# EAGLE schematic scheme (EAGLE 9.6.1)
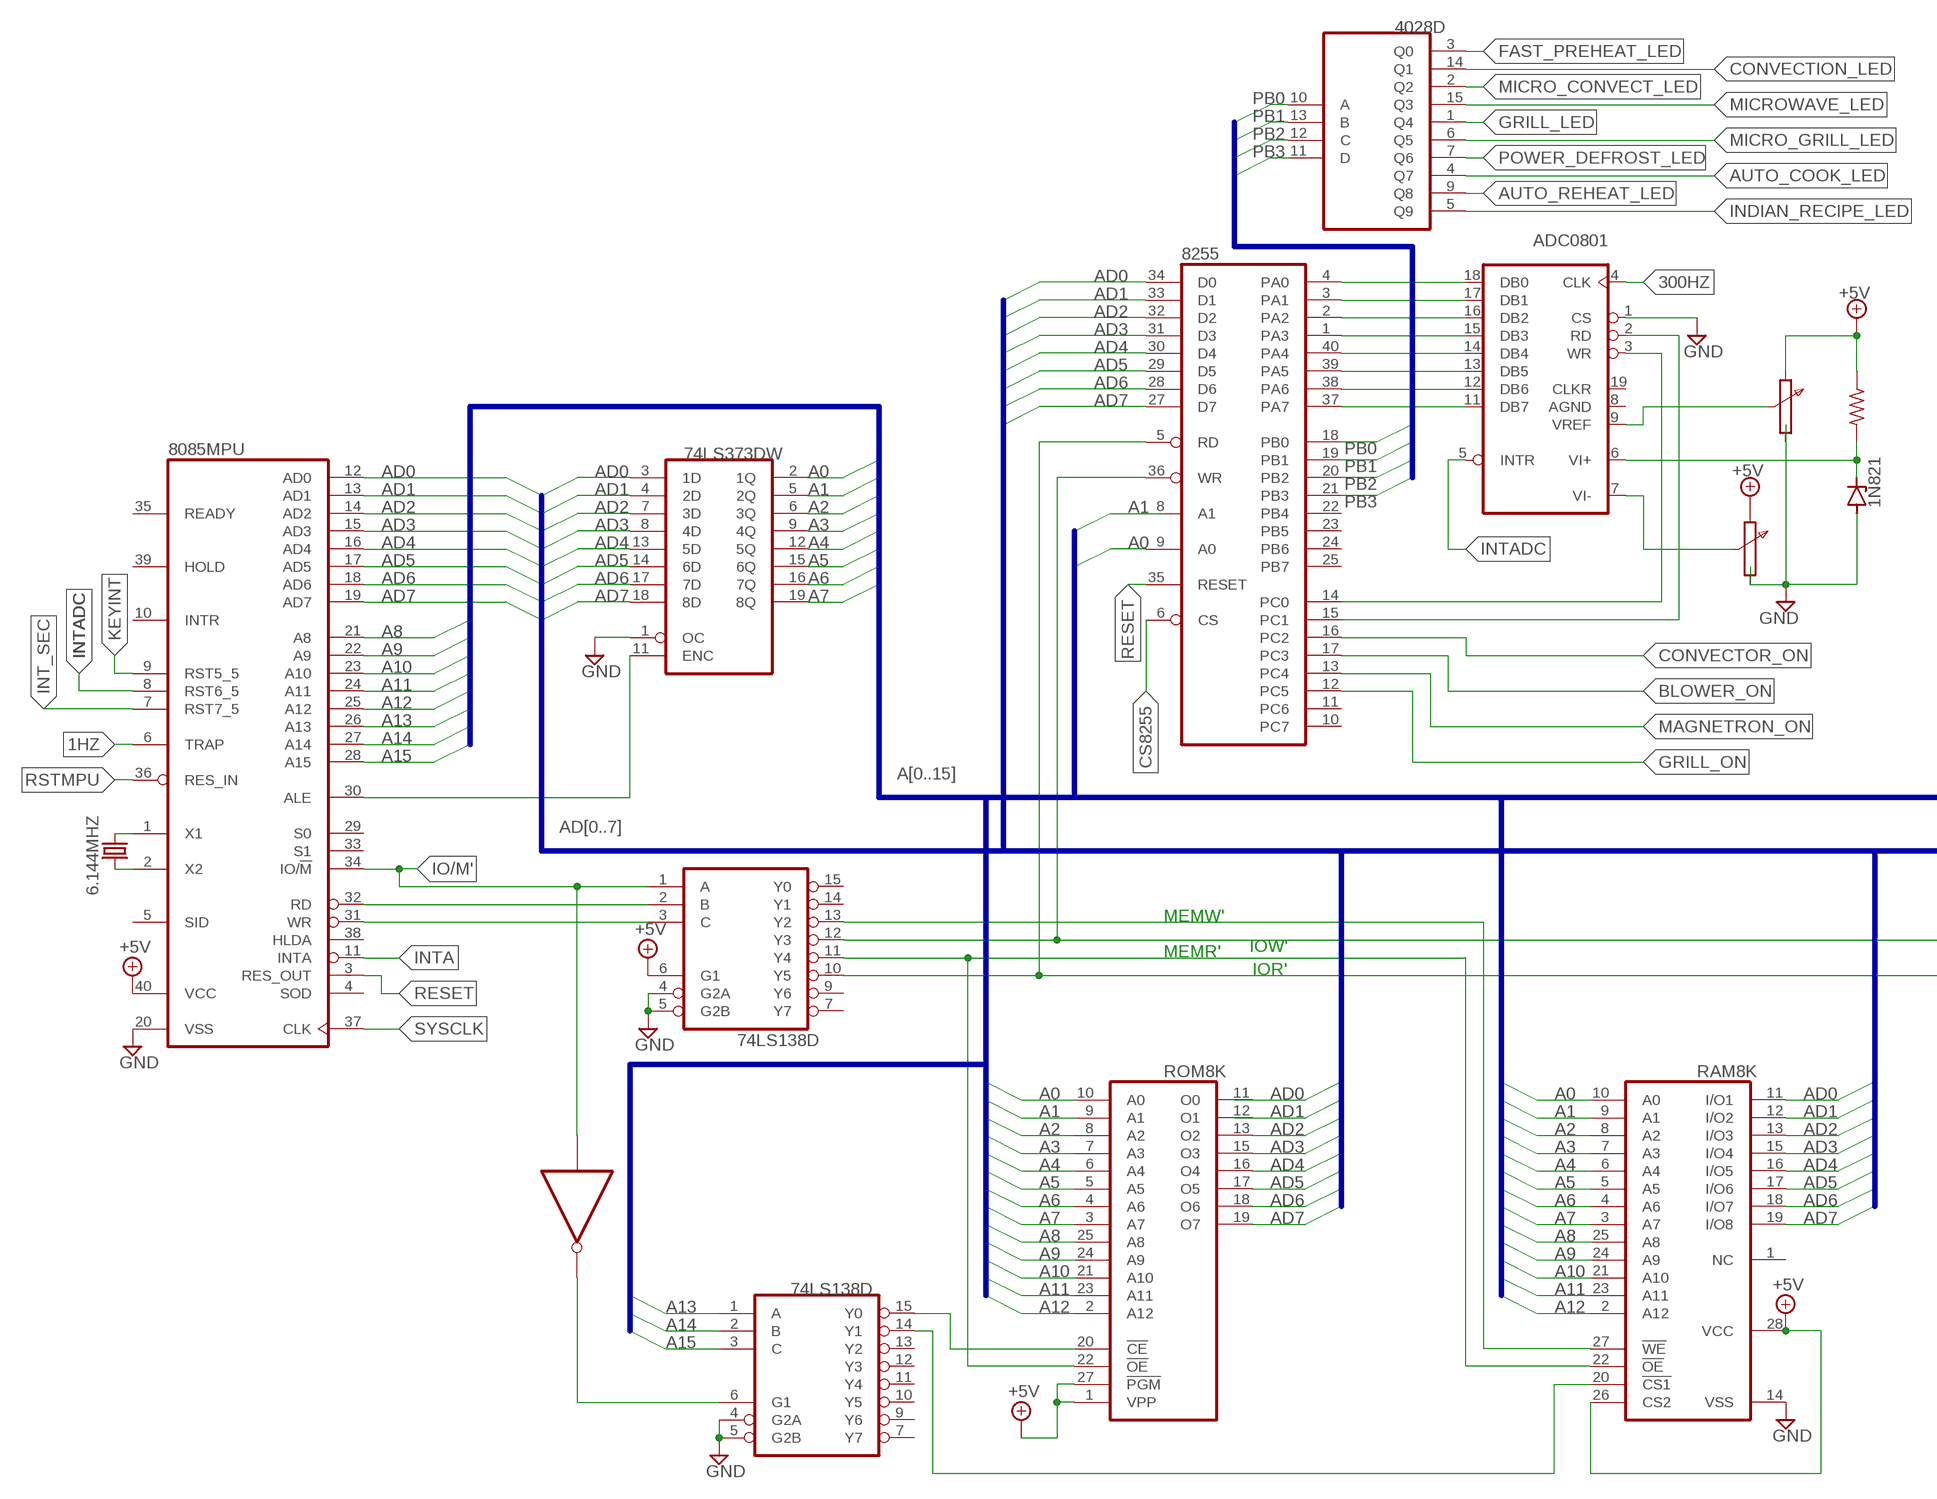
[diagram p0: schematic, sheet 1, part 1 of 2]
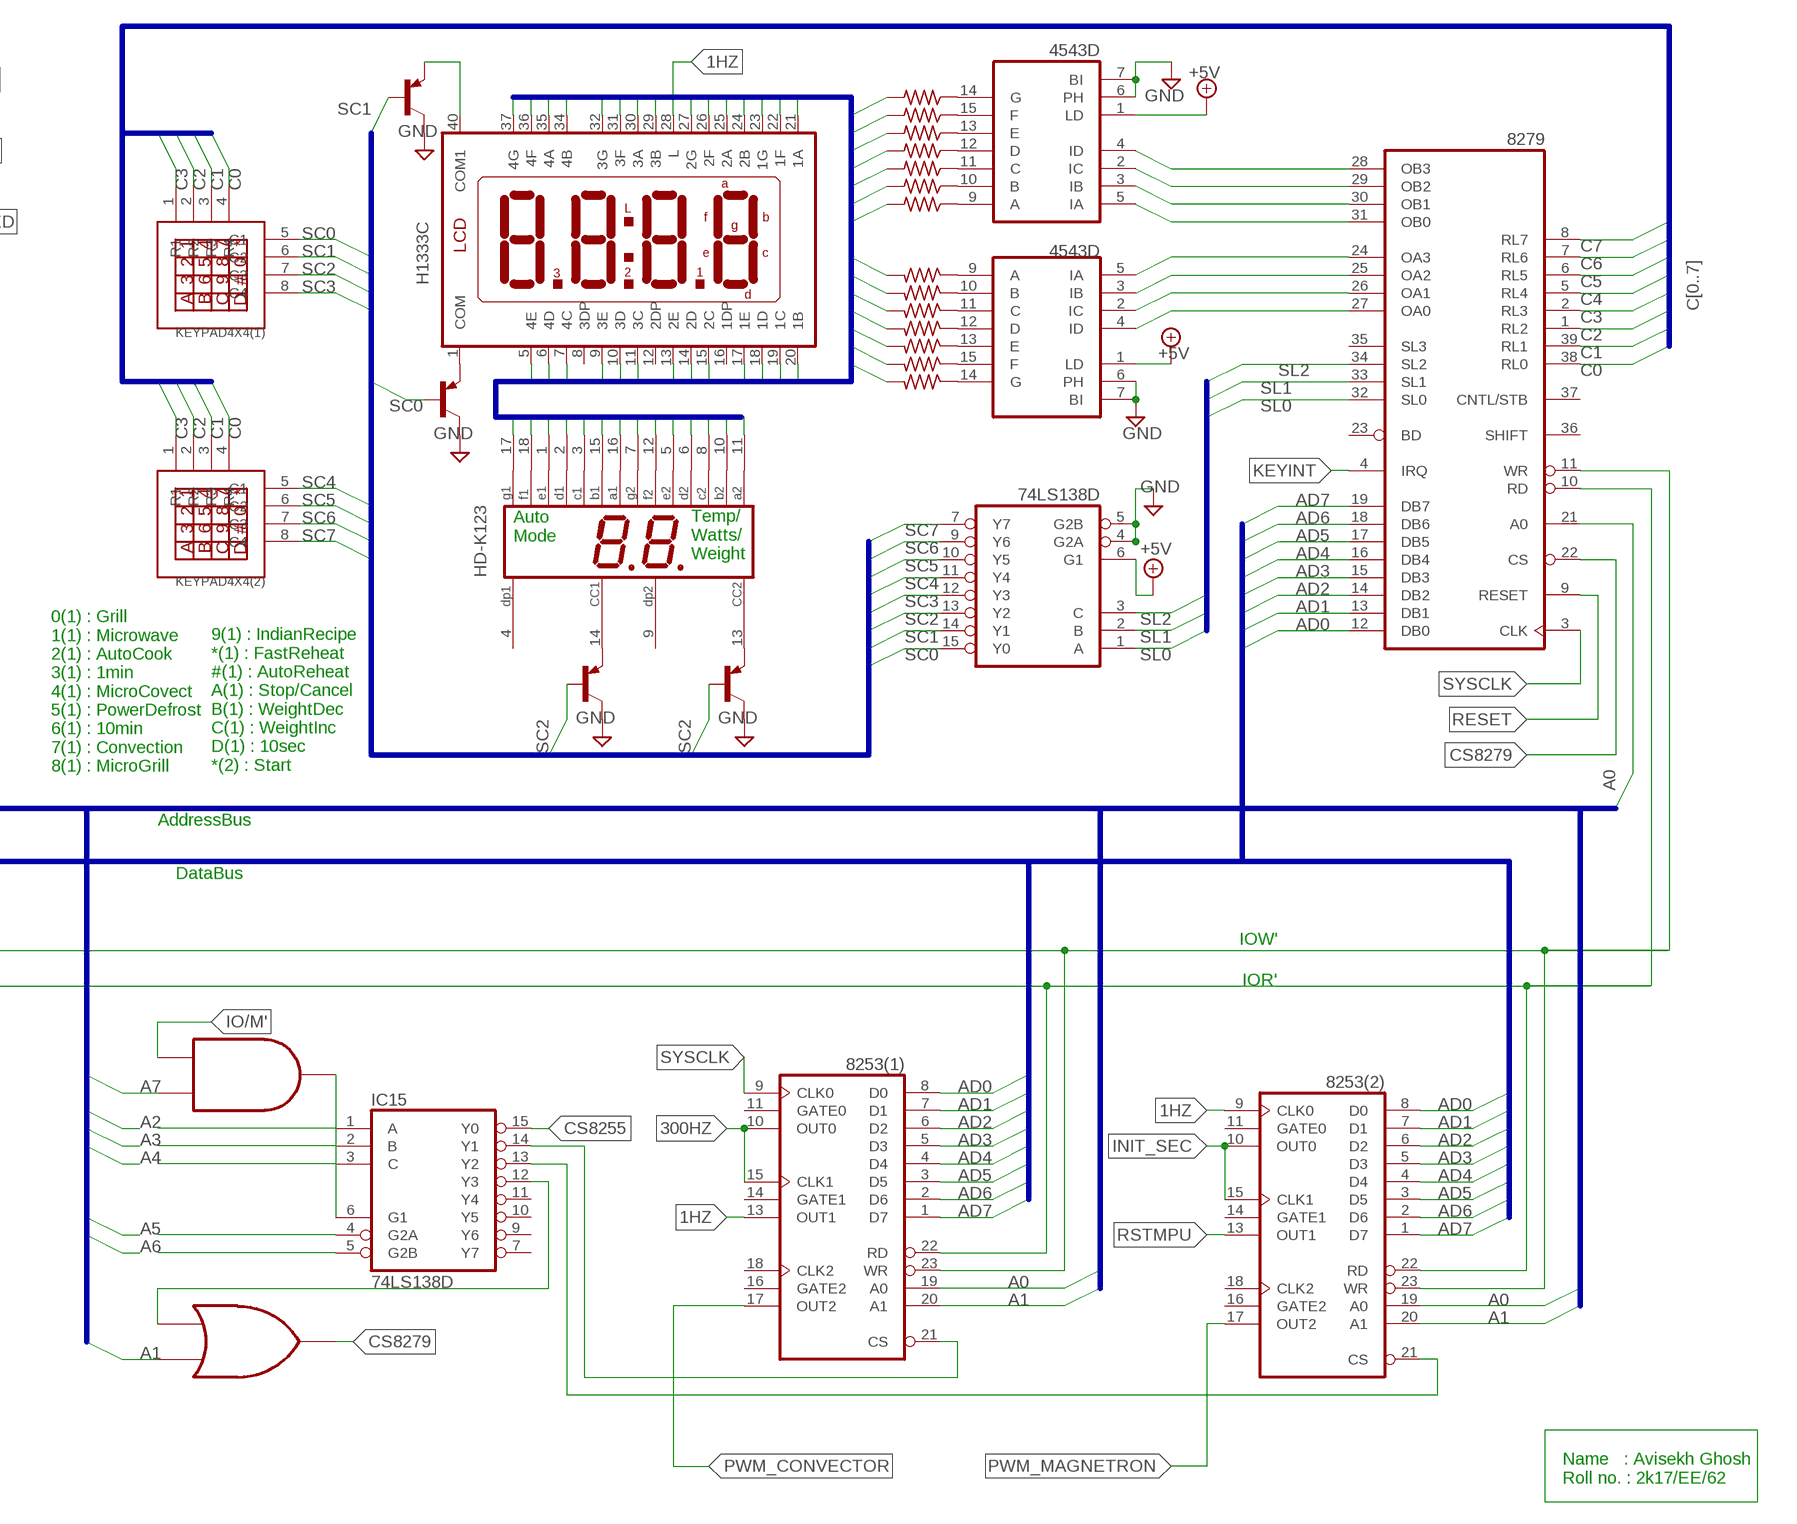
[diagram p1: schematic, sheet 1, part 2 of 2]

## Parts
6.144MHZ  CSM-7X-DU  [CSM-7X-DU]
8085MPU  8085  [DIL40]
8253(1)  8253  [DIL24-6]
8253(2)  8253  [DIL24-6]
8255  8255A  [DIL40]
8279  8279  [DIL40]
D1  1N821  [DO35Z10]
DIS2  H1333C  [H1333C]
DIS3  HD-K123  [HDSP-R]
IC1  4028D  [SO16]
IC2  74LS373DW  [SO20W]
IC3  74LS138D  [SO16]
IC14  74LS138D  [SO16]
IC15  74LS138D  [SO16]
IC19  ADC0801  [DIL20]
IC21  74LS138D  [SO16]
IC25  4543D  [SO16]
IC26  4543D  [SO16]
KEYPAD4X4(1)  KEYPAD4X4(1)  KEYPAD4X4  [KEYPAD4X4]
Q2  2N2907  [TO92-EBC-OVAL]
Q5  2N2907  [TO92-EBC-OVAL]
Q6  2N2907  [TO92-EBC-OVAL]
Q7  2N2907  [TO92-EBC-OVAL]
R1  10K  R-US_0207/12  [0207/12]
R57  10K  R-US_0207/12  [0207/12]
R58  10K  R-US_0207/12  [0207/12]
R59  10K  R-US_0207/12  [0207/12]
R60  10K  R-US_0207/12  [0207/12]
R61  10K  R-US_0207/12  [0207/12]
R62  10K  R-US_0207/12  [0207/12]
R63  10K  R-US_0207/12  [0207/12]
R64  10K  R-US_0207/12  [0207/12]
R65  10K  R-US_0207/12  [0207/12]
R66  10K  R-US_0207/12  [0207/12]
R67  10K  R-US_0207/12  [0207/12]
R68  10K  R-US_0207/12  [0207/12]
R69  10K  R-US_0207/12  [0207/12]
R70  10K  R-US_0207/12  [0207/12]
RAM8K  6264A  [DIL28-6]
ROM8K  2764  [DIL28]
U$2  KEYPAD4X4(2)  KEYPAD4X4  [KEYPAD4X4]
X1  INVERTER  (no package)
X2  AND  (no package)
X3  OR  (no package)

## Nets
1HZ: 8085MPU.6(TRAP) 8253(1).13(OUT1) 8253(2).9(CLK0) DIS2.28(L)
300HZ: 8253(1).10(OUT0) 8253(1).15(CLK1) IC19.4(CLK)
+5V: 8085MPU.40(VCC) IC3.6(G1) IC21.6(G1) IC25.1(LD) IC26.1(LD) R1.1 RAM8K.26(CS2) RAM8K.28(VCC) ROM8K.1(VPP) ROM8K.27(!PGM)
A0: 8253(1).19(A0) 8253(2).19(A0) 8255.9(A0) 8279.21(A0) DIS2.11(3C) DIS2.21(1A) DIS2.30(3A) DIS3.16(A1) IC2.2(1Q) R64.2 RAM8K.10(A0) ROM8K.10(A0)
A1: 8253(1).20(A1) 8253(2).20(A1) 8255.8(A1) DIS2.25(2A) DIS2.35(4A) DIS3.11(A2) IC2.5(2Q) R57.2 RAM8K.9(A1) ROM8K.9(A1) X3.B
A2: IC2.6(3Q) RAM8K.8(A2) ROM8K.8(A2)
A3: IC2.9(4Q) RAM8K.7(A3) ROM8K.7(A3)
A4: IC2.12(5Q) RAM8K.6(A4) ROM8K.6(A4)
A5: IC2.15(6Q) RAM8K.5(A5) ROM8K.5(A5)
A6: IC2.16(7Q) RAM8K.4(A6) ROM8K.4(A6)
A7: IC2.19(8Q) RAM8K.3(A7) ROM8K.3(A7) X2.B
A8: 8085MPU.21(A8) RAM8K.25(A8) ROM8K.25(A8)
A9: 8085MPU.22(A9) RAM8K.24(A9) ROM8K.24(A9)
A10: 8085MPU.23(A10) RAM8K.21(A10) ROM8K.21(A10)
A11: 8085MPU.24(A11) RAM8K.23(A11) ROM8K.23(A11)
A12: 8085MPU.25(A12) RAM8K.2(A12) ROM8K.2(A12)
A13: 8085MPU.26(A13) IC14.1(A)
A14: 8085MPU.27(A14) IC14.2(B)
A15: 8085MPU.28(A15) IC14.3(C)
AD0: 8085MPU.12(AD0) 8253(1).8(D0) 8253(2).8(D0) 8255.34(D0) 8279.12(DB0) IC2.3(1D) RAM8K.11(I/O1)
AD1: 8085MPU.13(AD1) 8253(1).7(D1) 8253(2).7(D1) 8255.33(D1) 8279.13(DB1) IC2.4(2D) RAM8K.12(I/O2)
AD2: 8085MPU.14(AD2) 8253(1).6(D2) 8253(2).6(D2) 8255.32(D2) 8279.14(DB2) IC2.7(3D) RAM8K.13(I/O3) ROM8K.13(O2)
AD3: 8085MPU.15(AD3) 8253(1).5(D3) 8253(2).5(D3) 8255.31(D3) 8279.15(DB3) IC2.8(4D) RAM8K.15(I/O4) ROM8K.15(O3)
AD4: 8085MPU.16(AD4) 8253(1).4(D4) 8253(2).4(D4) 8255.30(D4) 8279.16(DB4) IC2.13(5D) RAM8K.16(I/O5) ROM8K.16(O4)
AD5: 8085MPU.17(AD5) 8253(1).3(D5) 8253(2).3(D5) 8255.29(D5) 8279.17(DB5) IC2.14(6D) RAM8K.17(I/O6) ROM8K.17(O5)
AD6: 8085MPU.18(AD6) 8253(1).2(D6) 8253(2).2(D6) 8255.28(D6) 8279.18(DB6) IC2.17(7D) RAM8K.18(I/O7) ROM8K.18(O6)
AD7: 8085MPU.19(AD7) 8253(1).1(D7) 8253(2).1(D7) 8255.27(D7) 8279.19(DB7) IC2.18(8D) RAM8K.19(I/O8) ROM8K.19(O7)
AUTO_COOK_LED: IC1.4(Q7)
AUTO_REHEAT_LED: IC1.9(Q8)
B0: DIS2.20(1B) DIS2.29(3B) DIS3.15(B1) R65.2
B1: DIS2.24(2B) DIS2.34(4B) DIS3.10(B2) R58.2
BLOWER_ON: 8255.17(PC3)
C0: 8279.38(RL0) DIS2.19(1C) DIS3.3(C1) KEYPAD4X4(1).4(R4) R66.2 U$2.4(R4)
C1: 8279.39(RL1) DIS2.7(4C) DIS2.15(2C) DIS3.8(C2) KEYPAD4X4(1).3(R3) R59.2 U$2.3(R3)
C2: 8279.1(RL2) KEYPAD4X4(1).2(R2) U$2.2(R2)
C3: 8279.2(RL3) KEYPAD4X4(1).1(R1) U$2.1(R1)
C4: 8279.5(RL4)
C5: 8279.6(RL5)
C6: 8279.7(RL6)
C7: 8279.8(RL7)
CONVECTION_LED: IC1.14(Q1)
CONVECTOR_ON: 8255.16(PC2)
CS8255: 8255.6(CS) IC15.15(Y0)
CS8279: 8279.22(CS) X3.Y
D0: DIS2.10(3D) DIS2.18(1D) DIS3.2(D1) R67.2
D1: DIS2.6(4D) DIS2.14(2D) DIS3.6(D2) R60.2
E0: DIS2.9(3E) DIS2.17(1E) DIS3.1(E1) R68.2
E1: DIS2.5(4E) DIS2.13(2E) DIS3.5(E2) R61.2
F0: DIS2.22(1F) DIS2.31(3F) DIS3.18(F1) R69.2
F1: DIS2.26(2F) DIS2.36(4F) DIS3.12(F2) R62.2
FAST_PREHEAT_LED: IC1.3(Q0)
G0: DIS2.23(1G) DIS2.32(3G) DIS3.17(G1) R70.2
G1: DIS2.27(2G) DIS2.37(4G) DIS3.7(G2) R63.2
GND: 8085MPU.20(VSS) D1.A IC2.1(OC) IC3.4(G2A) IC3.5(G2B) IC14.4(G2A) IC14.5(G2B) IC19.1(CS) IC21.4(G2A) IC21.5(G2B) IC25.6(PH) IC25.7(BI) IC26.6(PH) IC26.7(BI) Q2.C Q5.C Q6.C Q7.C RAM8K.14(VSS)
GRILL_LED: IC1.1(Q4)
GRILL_ON: 8255.12(PC5)
INDIAN_RECIPE_LED: IC1.5(Q9)
INIT_SEC: 8253(2).10(OUT0) 8253(2).15(CLK1)
INT_SEC: 8085MPU.7(RST7_5)
INTA: 8085MPU.11(INTA)
INTADC: 8085MPU.8(RST6_5) IC19.5(INTR)
IO/M': 8085MPU.34(IO/!M) IC3.1(A) X1.I X2.A
KEYINT: 8085MPU.9(RST5_5) 8279.4(IRQ)
MAGNETRON_ON: 8255.13(PC4)
MICRO_CONVECT_LED: IC1.2(Q2)
MICRO_GRILL_LED: IC1.6(Q5)
MICROWAVE_LED: IC1.15(Q3)
N$1: 8085MPU.30(ALE) IC2.11(ENC)
N$2: 8085MPU.32(RD) IC3.2(B)
N$3: 8085MPU.31(WR) IC3.3(C)
N$4: IC15.6(G1) X2.Y
N$5: IC3.11(Y4) RAM8K.22(!OE) ROM8K.22(!OE)
N$6: IC3.13(Y2) RAM8K.27(!WE)
N$7: ROM8K.11(O0)
N$8: D1.C IC19.6(VI+) R1.2
N$9: IC15.1(A)
N$10: IC15.2(B)
N$11: IC15.3(C)
N$12: IC15.4(G2A)
N$13: IC15.5(G2B)
N$14: IC15.12(Y3) X3.A
N$15: DIS3.14(CC1) Q2.E
N$16: DIS3.13(CC2) Q5.E
N$17: 8253(1).23(WR) 8253(2).23(WR) 8255.36(WR) 8279.11(WR) IC3.12(Y3)
N$18: ROM8K.12(O1)
N$19: DIS2.1(COM) Q6.E
N$20: DIS2.40(COM1) Q7.E
N$22: IC14.6(G1) X1.O
N$23: IC14.15(Y0) ROM8K.20(!CE)
N$24: IC14.14(Y1) RAM8K.20(!CS1)
N$25: 6.144MHZ.1 8085MPU.1(X1)
N$26: 8253(1).21(CS) IC15.14(Y1)
N$27: 8253(2).21(CS) IC15.13(Y2)
N$28: 6.144MHZ.2 8085MPU.2(X2)
N$30: IC19.9(VREF)
N$31: IC19.7(VI-)
N$32: 8253(1).22(RD) 8253(2).22(RD) 8255.5(RD) 8279.10(RD) IC3.10(Y5)
N$33: 8255.4(PA0) IC19.18(DB0)
N$34: 8255.3(PA1) IC19.17(DB1)
N$35: 8255.2(PA2) IC19.16(DB2)
N$36: 8255.1(PA3) IC19.15(DB3)
N$37: 8255.40(PA4) IC19.14(DB4)
N$38: 8255.39(PA5) IC19.13(DB5)
N$39: 8255.38(PA6) IC19.12(DB6)
N$40: 8255.37(PA7) IC19.11(DB7)
N$41: 8255.14(PC0) IC19.3(WR)
N$42: 8255.15(PC1) IC19.2(RD)
N$93: IC25.9(A) R57.1
N$94: IC25.10(B) R58.1
N$95: IC25.11(C) R59.1
N$96: IC25.12(D) R60.1
N$97: IC25.13(E) R61.1
N$98: IC25.15(F) R62.1
N$99: IC25.14(G) R63.1
N$100: IC26.9(A) R64.1
N$101: IC26.10(B) R65.1
N$102: IC26.11(C) R66.1
N$103: IC26.12(D) R67.1
N$104: IC26.13(E) R68.1
N$105: IC26.15(F) R69.1
N$106: IC26.14(G) R70.1
N$107: 8279.28(OB3) IC25.4(ID)
N$108: 8279.29(OB2) IC25.2(IC)
N$109: 8279.30(OB1) IC25.3(IB)
N$110: 8279.31(OB0) IC25.5(IA)
N$111: 8279.24(OA3) IC26.5(IA)
N$112: 8279.25(OA2) IC26.3(IB)
N$113: 8279.26(OA1) IC26.2(IC)
N$114: 8279.27(OA0) IC26.4(ID)
PB0: 8255.18(PB0) IC1.10(A)
PB1: 8255.19(PB1) IC1.13(B)
PB2: 8255.20(PB2) IC1.12(C)
PB3: 8255.21(PB3) IC1.11(D)
POWER_DEFROST_LED: IC1.7(Q6)
PWM_CONVECTOR: 8253(1).17(OUT2)
PWM_MAGNETRON: 8253(2).17(OUT2)
RESET: 8085MPU.3(RES_OUT) 8255.35(RESET) 8279.9(RESET)
RSTMPU: 8085MPU.36(RES_IN) 8253(2).13(OUT1)
SC0: IC21.15(Y0) KEYPAD4X4(1).5(C1) Q6.B
SC1: IC21.14(Y1) KEYPAD4X4(1).6(C2) Q7.B
SC2: IC21.13(Y2) KEYPAD4X4(1).7(C3) Q2.B Q5.B
SC3: IC21.12(Y3) KEYPAD4X4(1).8(C4)
SC4: IC21.11(Y4) U$2.5(C1)
SC5: IC21.10(Y5) U$2.6(C2)
SC6: IC21.9(Y6) U$2.7(C3)
SC7: IC21.7(Y7) U$2.8(C4)
SL0: 8279.32(SL0) IC21.1(A)
SL1: 8279.33(SL1) IC21.2(B)
SL2: 8279.34(SL2) IC21.3(C)
SYSCLK: 8085MPU.37(CLK) 8253(1).9(CLK0) 8279.3(CLK)
Unconnected: 8085MPU.4(SOD) 8085MPU.5(SID) 8085MPU.10(INTR) 8085MPU.29(S0) 8085MPU.33(S1) 8085MPU.35(READY) 8085MPU.38(HLDA) 8085MPU.39(HOLD) 8253(1).11(GATE0) 8253(1).14(GATE1) 8253(1).16(GATE2) 8253(1).18(CLK2) 8253(2).11(GATE0) 8253(2).14(GATE1) 8253(2).16(GATE2) 8253(2).18(CLK2) 8255.10(PC7) 8255.11(PC6) 8255.22(PB4) 8255.23(PB5) 8255.24(PB6) 8255.25(PB7) 8279.23(BD) 8279.35(SL3) 8279.36(SHIFT) 8279.37(CNTL/STB) DIS2.8(3DP) DIS2.12(2DP) DIS2.16(1DP) DIS3.4(DP1) DIS3.9(DP2) IC3.7(Y7) IC3.9(Y6) IC3.14(Y1) IC3.15(Y0) IC14.7(Y7) IC14.9(Y6) IC14.10(Y5) IC14.11(Y4) IC14.12(Y3) IC14.13(Y2) IC15.7(Y7) IC15.9(Y6) IC15.10(Y5) IC15.11(Y4) IC19.8(AGND) IC19.19(CLKR) RAM8K.1(NC)

## Buses
AD[0..7]
A[0..15]
SC[0..7]
SL[0..2]
A[0..1],B[0..1],C[0..1],D[0..1],E[0..1],F[0..1],G[0..1]
C[0..7]
PB[0..3]

## Notes on the sheet
- Auto
  Mode
- Temp/
  Watts/
  Weight
- 0(1) : Grill
  1(1) : Microwave
  2(1) : AutoCook
  3(1) : 1min
  4(1) : MicroCovect
  5(1) : PowerDefrost
  6(1) : 10min
  7(1) : Convection
  8(1) : MicroGrill
- 9(1) : IndianRecipe
  *(1) : FastReheat
  #(1) : AutoReheat
  A(1) : Stop/Cancel
  B(1) : WeightDec
  C(1) : WeightInc
  D(1) : 10sec
  *(2) : Start
- AddressBus
- DataBus
- MEMW' | IOW'
- IOW'
- MEMR'
- IOR' | IOR'
- Name   : Avisekh Ghosh
  Roll no. : 2k17/EE/62

## Power pins joined to a net without a drawn wire
GND: 8253(1).12(GND) 8253(2).12(GND) 8255.7(GND) 8279.20(GND) IC2.10(GND) IC3.8(GND) IC14.8(GND) IC15.8(GND) IC19.10(GND) IC21.8(GND) ROM8K.14(GND)
VCC: 8253(1).24(VCC) 8253(2).24(VCC) 8255.26(VCC) 8279.40(VCC) IC2.20(VCC) IC3.16(VCC) IC14.16(VCC) IC15.16(VCC) IC19.20(VCC) IC21.16(VCC) ROM8K.28(VCC)
VDD: IC1.16(VDD) IC25.16(VDD) IC26.16(VDD)
VSS: IC1.8(VSS) IC25.8(VSS) IC26.8(VSS)

## Library data of the parts
6.144MHZ = crystal:CSM-7X-DU: SMD CRYSTAL Source: www.ecsxtal.com .. Crystal 3.6864MHz CSM_7X_DU.PDF; OC_FARNELL: unknown; OC_NEWARK: unknown
8085MPU = micro-intel:8085: MICROCOMPUTER/PERIPHERAL DEVICE; OC_FARNELL: unknown; OC_NEWARK: unknown
8253(1) 8253(2) = micro-intel:8253: MICROCOMPUTER/PERIPHERAL DEVICE; OC_FARNELL: unknown; OC_NEWARK: unknown
8255 = micro-intel:8255A: MICROCOMPUTER/PERIPHERAL DEVICE; OC_FARNELL: unknown; OC_NEWARK: unknown
8279 = micro-intel:8279: MICROCOMPUTER/PERIPHERAL DEVICE; OC_FARNELL: unknown; OC_NEWARK: unknown
D1 = diode:1N821: Reference DIODE temperature compensated, 6,2 V
DIS2 = display-lcd:H1333C: LCD DISPLAY 4-character 7 segment; OC_FARNELL: unknown; OC_NEWARK: unknown
DIS3 = display-hp:HD-K123: LED DISPLAY 2 x 1 character 7 segment, decimal points right; OC_FARNELL: unknown; OC_NEWARK: unknown
IC1 = 40xx:4028: BCD to decimal DECODER
IC2 = 74xx-us:74*373: Octal D type transparent LATCH, edge triggered
IC3 IC14 IC15 IC21 = 74xx-us:74*138: 3-line to 8-line DECODER/DEMULTIPLEXER
IC19 = linear:ADC0801: 8-bit A/D CONVERTER
IC25 IC26 = 45xx:4543: BCD to 7-segment LCD DECODER
KEYPAD4X4(1) U$2 = keypad4x4_ece:KEYPAD4X4
Q2 Q5-Q7 = adafruit:2N2907*: PNP Transistor Big Oval pads
R1 R57-R70 = rcl:R-US_: RESISTOR, American symbol; SPICEPREFIX: R
RAM8K = memory-hitachi:6264A: MEMORY; OC_FARNELL: 283605; OC_NEWARK: unknown
ROM8K = memory:2764: MEMORY
X1 = ngspice-digital:INVERTER: logic inverter (NOT gate)
X2 = ngspice-digital:AND: 2 input logic AND gate
X3 = ngspice-digital:OR: 2 input logic OR gate